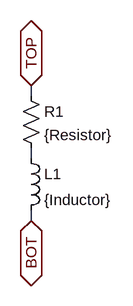
[diagram p0: schematic Fig_2-173_RL_Element.asc]
Fig_2-173_RL_Element.asc, the LTspice schematic file:
Version 4
SHEET 1 880 680
WIRE 192 96 192 80
WIRE 192 192 192 176
WIRE 192 288 192 272
FLAG 192 80 TOP
IOPIN 192 80 BiDir
FLAG 192 288 BOT
IOPIN 192 288 BiDir
SYMBOL res 176 80 R0
SYMATTR InstName R1
SYMATTR Value {Resistor}
SYMBOL ind 176 176 R0
SYMATTR InstName L1
SYMATTR Value {Inductor}

The netlist it stands for:
* Fig_2-173_RL_Element.asc
R1 TOP N001 {Resistor}
L1 N001 BOT {Inductor}
.backanno
.end